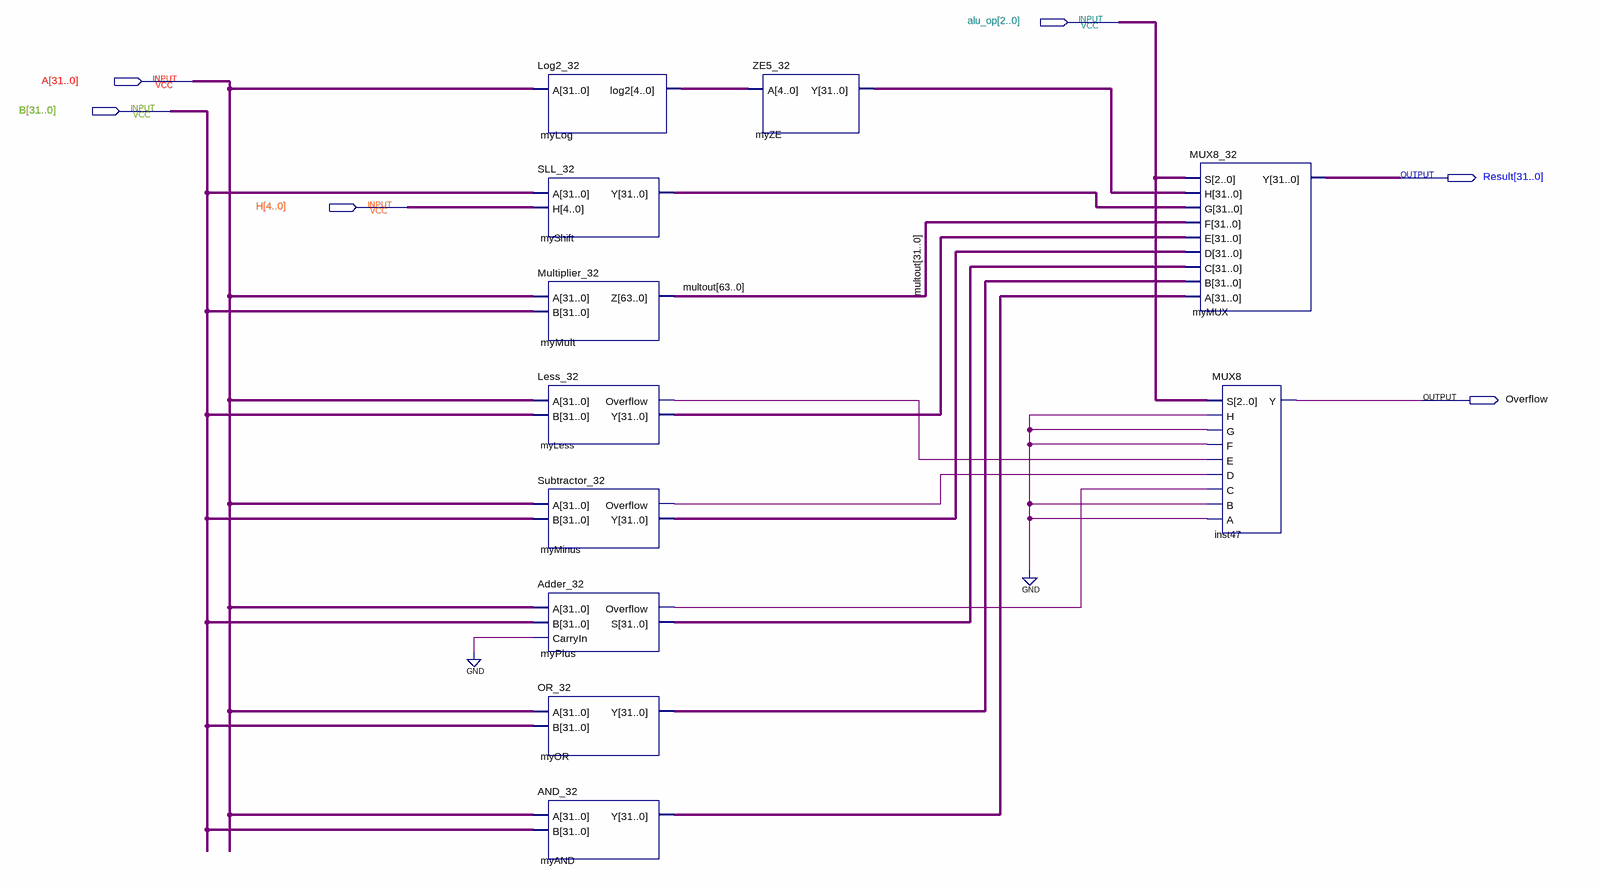
[diagram p0: schematic sheet]
// Quartus schematic ALU_32.bdf as structural Verilog: 11 symbols, 6 pins
module ALU_32 (
  input  [2:0] alu_op,
  input  [31:0] A,
  input  [31:0] B,
  input  [4:0] H,
  output [31:0] Result,
  output Overflow
);

  wire myLess_overflow, myMinus_overflow, myPlus_overflow;
  wire [4:0] myLog_log2;
  wire [31:0] myAND_y, myLess_y, myMinus_y, myOR_y, myPlus_s, myShift_y, myZE_y;
  wire [63:0] multout;

  Log2_32 myLog (.A(A), .log2(myLog_log2));
  SLL_32 myShift (.A(B), .H(H), .Y(myShift_y));
  Multiplier_32 myMult (.A(A), .B(B), .Z(multout));
  Less_32 myLess (.A(A), .B(B), .Overflow(myLess_overflow), .Y(myLess_y));
  Subtractor_32 myMinus (.A(A), .B(B), .Overflow(myMinus_overflow), .Y(myMinus_y));
  Adder_32 myPlus (.A(A), .B(B), .CarryIn(1'b0), .Overflow(myPlus_overflow), .S(myPlus_s));
  OR_32 myOR (.A(A), .B(B), .Y(myOR_y));
  AND_32 myAND (.A(A), .B(B), .Y(myAND_y));
  ZE5_32 myZE (.A(myLog_log2), .Y(myZE_y));
  MUX8_32 myMUX (
    .S(alu_op), .H(myZE_y), .G(myShift_y), .F(multout[31:0]), .E(myLess_y), .D(myMinus_y), .C(myPlus_s),
    .B(myOR_y), .A(myAND_y), .Y(Result));
  MUX8 inst47 (
    .S(alu_op), .H(1'b0), .G(1'b0), .F(1'b0), .E(myLess_overflow), .D(myMinus_overflow), .C(myPlus_overflow),
    .B(1'b0), .A(1'b0), .Y(Overflow));
endmodule
